# Altium schematic sheet LVHVSCH.SchDoc
size A2
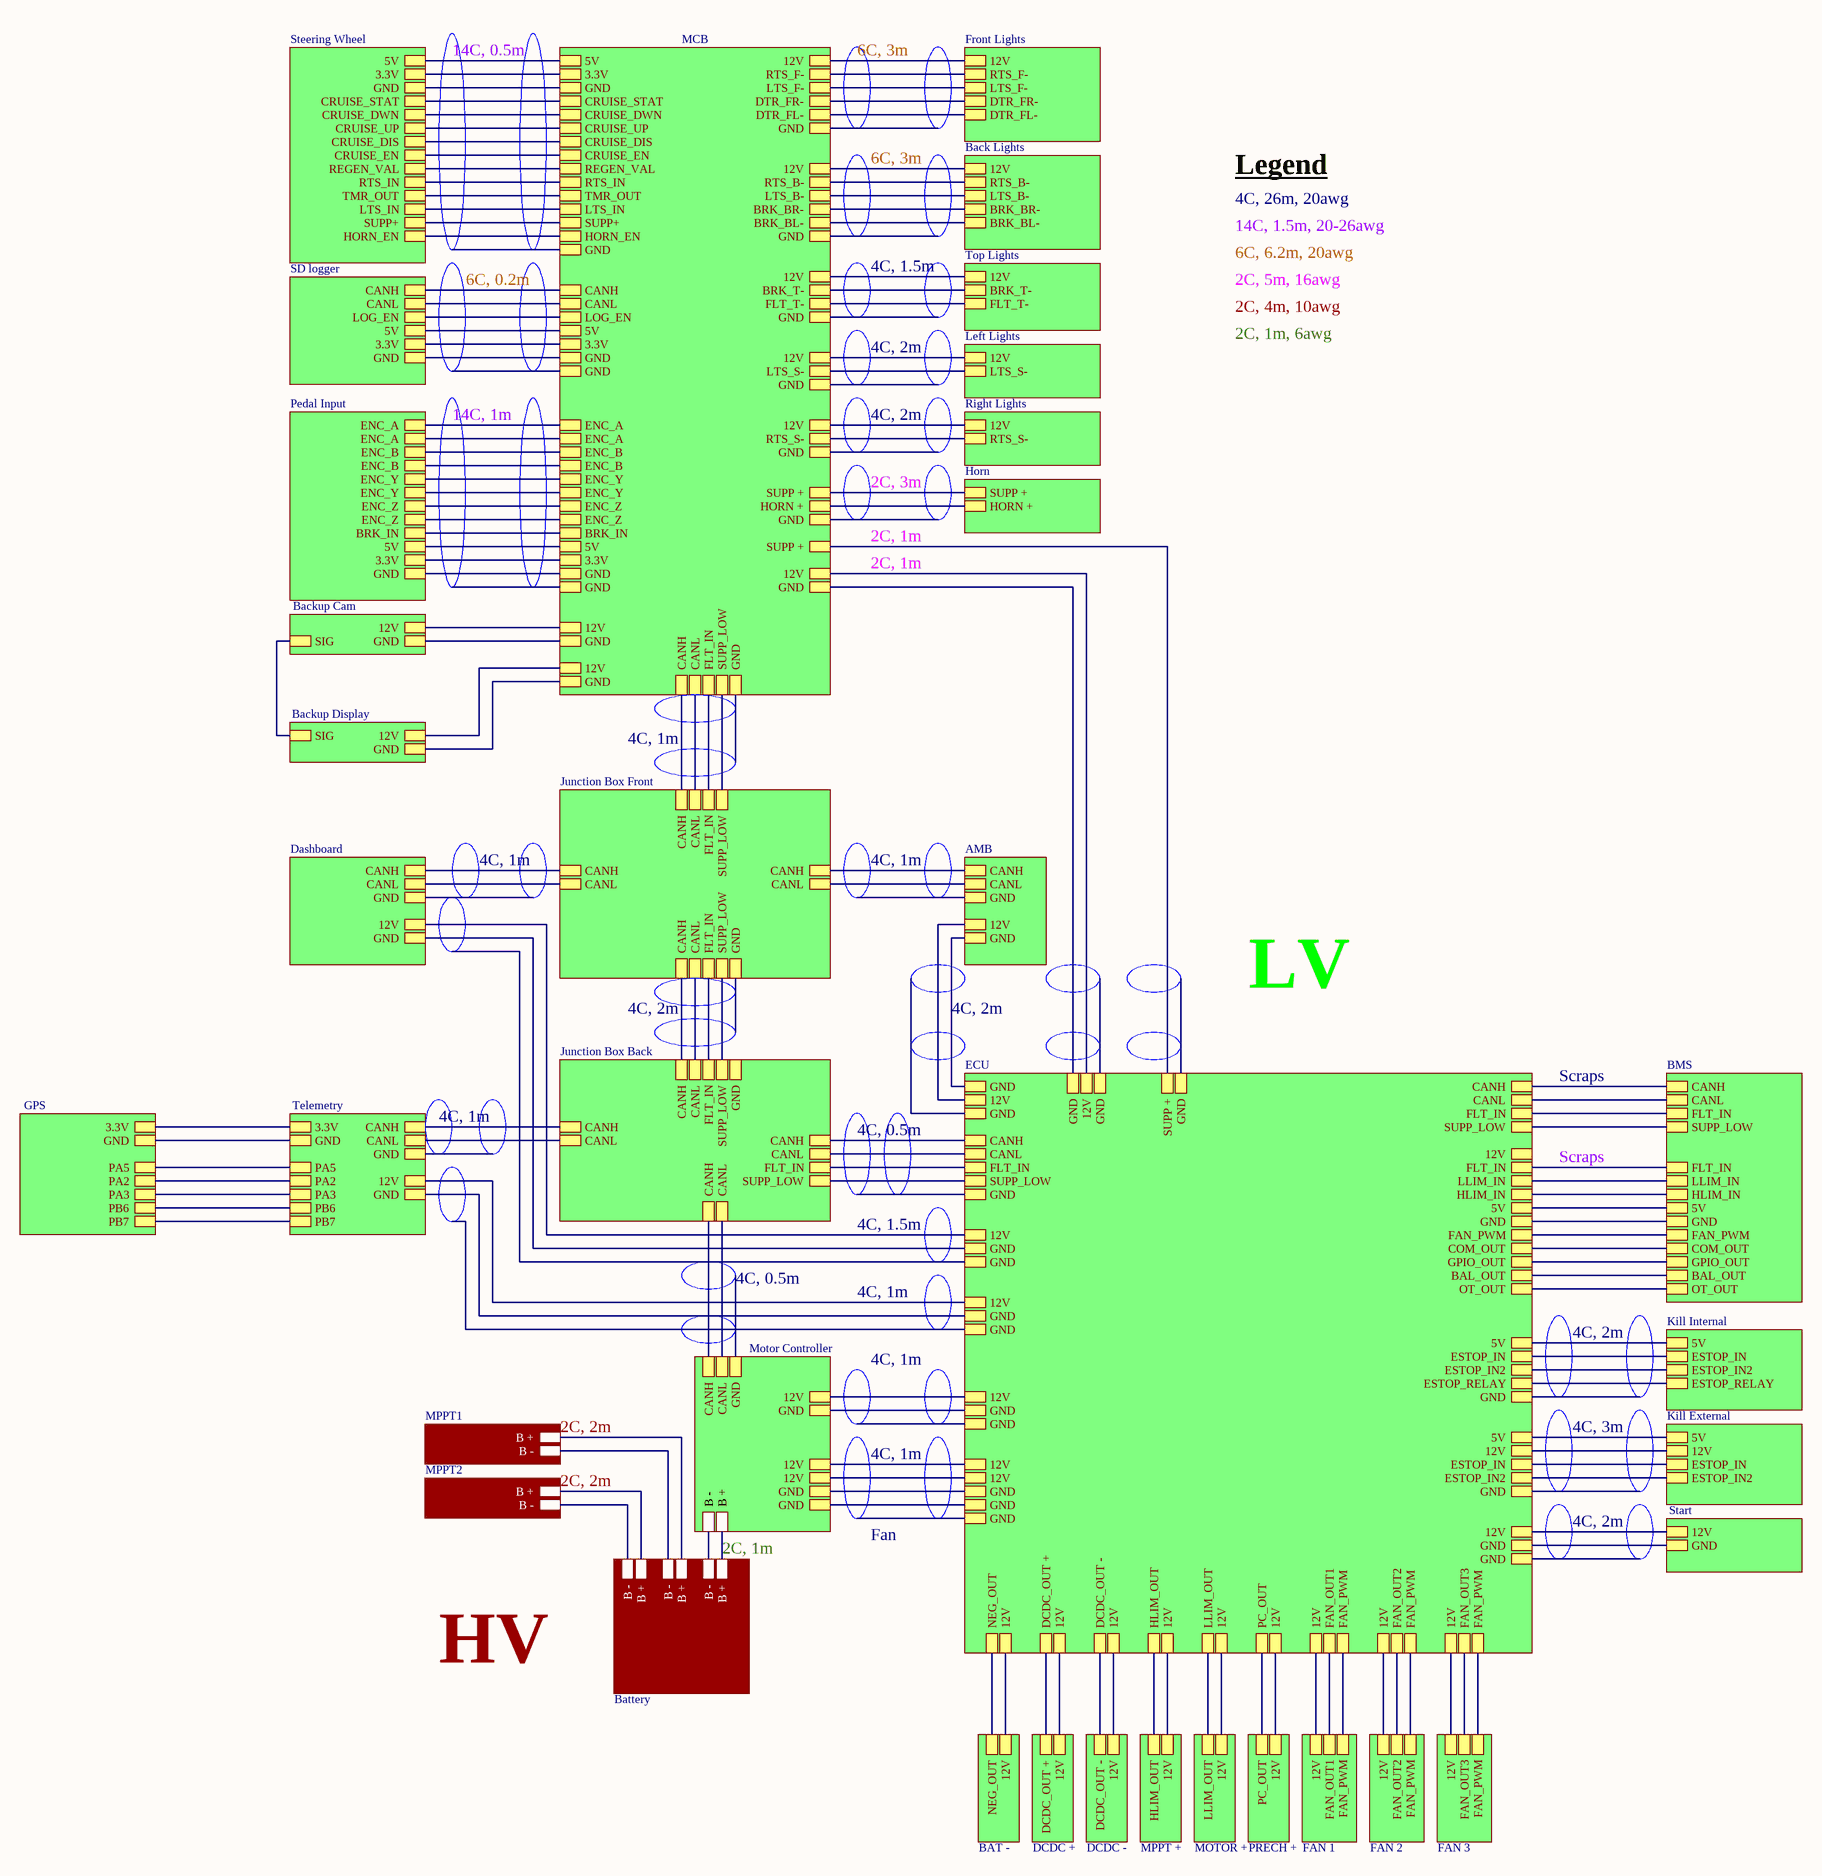
[diagram p0: LVHVSCH.SchDoc]

## Sub-sheets
? = MCB: 12V, RTS_F-, LTS_F-, DTR_FR-, DTR_FL-, RTS_B-, LTS_B-, BRK_BR-, BRK_BL-, LTS_S-, RTS_S-, BRK_T-, FLT_T-, 5V, 3.3V, GND, CRUISE_STAT, CRUISE_DWN, CRUISE_UP, CRUISE_DIS, CRUISE_EN, REGEN_VAL, RTS_IN, TMR_OUT, LTS_IN, SUPP+, HORN_EN, CANH, CANL, LOG_EN, ENC_A, ENC_B, ENC_Y, ENC_Z, BRK_IN, 12V, 12V, 12V, 12V, 5V, 3.3V, GND, 5V, 3.3V, GND, CANH, CANL, FLT_IN, SUPP_LOW, SUPP +, HORN +, ENC_A, ENC_B, ENC_Y, ENC_Z, SUPP +, 12V, GND, GND, GND, GND, GND, GND, GND, GND, GND, GND, GND, 12V, 12V, GND, GND
? = Front Lights: 12V, RTS_F-, LTS_F-, DTR_FR-, DTR_FL-
? = Back Lights: 12V, RTS_B-, LTS_B-, BRK_BR-, BRK_BL-
? = Top Lights: BRK_T-, FLT_T-, 12V
? = Left Lights: LTS_S-, 12V
? = Right Lights: 12V, RTS_S-
? = Steering Wheel: 5V, 3.3V, GND, CRUISE_STAT, CRUISE_DWN, CRUISE_UP, CRUISE_DIS, CRUISE_EN, REGEN_VAL, RTS_IN, TMR_OUT, LTS_IN, SUPP+, HORN_EN
? = SD logger: CANH, CANL, LOG_EN, 5V, 3.3V, GND
? = Pedal Input: ENC_A, ENC_B, ENC_Y, ENC_Z, BRK_IN, 5V, 3.3V, GND, ENC_A, ENC_B, ENC_Y, ENC_Z
? = Junction Box Front: CANL, CANH, CANH, CANL, CANH, CANL, FLT_IN, SUPP_LOW, CANH, CANL, FLT_IN, SUPP_LOW, GND
? = Dashboard: CANH, CANL, 12V, GND, GND
? = ECU: CANH, CANL, FLT_IN, SUPP_LOW, CANH, CANL, FLT_IN, SUPP_LOW, 12V, PC_OUT, NEG_OUT, 12V, DCDC_OUT +, 12V, HLIM_OUT, 12V, LLIM_OUT, 12V, 12V, GND, 5V, SUPP +, 12V, GND, ESTOP_IN, ESTOP_IN2, ESTOP_RELAY, 5V, 12V, ESTOP_IN, ESTOP_IN2, 12V, GND, 12V, GND, 12V, GND, 12V, GND, 12V, 12V, GND, GND, GND, GND, GND, GND, GND, GND, GND, GND, GND, GND, GND, FLT_IN, LLIM_IN, HLIM_IN, 12V, 12V, 12V, FAN_OUT1, FAN_OUT2, FAN_OUT3, FAN_PWM, FAN_PWM, FAN_PWM, 12V, 5V, GND, FAN_PWM, COM_OUT, GPIO_OUT, BAL_OUT, OT_OUT, DCDC_OUT -, 12V
? = Junction Box Back: CANL, CANH, CANH, FLT_IN, SUPP_LOW, CANL, CANH, CANL, CANH, CANL, FLT_IN, SUPP_LOW, GND
? = AMB: CANH, CANL, GND, 12V, GND
? = Motor Controller: CANH, CANL, 12V, GND, 12V, GND, 12V, GND, B +, B -, GND
? = Telemetry: CANH, CANL, 12V, GND, GND, 3.3V, GND, PA5, PA2, PA3, PB6, PB7
? = BMS: CANH, CANL, FLT_IN, SUPP_LOW, HLIM_IN, LLIM_IN, FLT_IN, 5V, GND, FAN_PWM, COM_OUT, GPIO_OUT, BAL_OUT, OT_OUT
? = Horn: SUPP +, HORN +
? = Kill Internal: 5V, ESTOP_IN, ESTOP_IN2, ESTOP_RELAY
? = Kill External: 5V, 12V, ESTOP_IN, ESTOP_IN2
? = Start: 12V, GND
? = BAT -: NEG_OUT, 12V
? = DCDC +: DCDC_OUT +, 12V
? = MPPT +: HLIM_OUT, 12V
? = MOTOR +: LLIM_OUT, 12V
? = PRECH +: PC_OUT, 12V
? = Battery: B -, B +, B +, B +, B -, B -
? = MPPT1: B +, B -
? = MPPT2: B +, B -
? = Backup Cam: 12V, GND, SIG
? = Backup Display: 12V, GND, SIG
? = FAN 1: FAN_PWM, 12V, FAN_OUT1
? = FAN 2: FAN_PWM, 12V, FAN_OUT2
? = FAN 3: FAN_PWM, 12V, FAN_OUT3
? = DCDC -: DCDC_OUT -, 12V
? = GPS: 3.3V, GND, PA5, PA2, PA3, PB6, PB7

## Nets
(unnamed): sheet /12V, sheet /12V
(unnamed): sheet /RTS_F-, sheet /RTS_F-
(unnamed): sheet /LTS_F-, sheet /LTS_F-
(unnamed): sheet /DTR_FR-, sheet /DTR_FR-
(unnamed): sheet /DTR_FL-, sheet /DTR_FL-
(unnamed): sheet /RTS_B-, sheet /RTS_B-
(unnamed): sheet /LTS_B-, sheet /LTS_B-
(unnamed): sheet /BRK_BR-, sheet /BRK_BR-
(unnamed): sheet /BRK_BL-, sheet /BRK_BL-
(unnamed): sheet /LTS_S-, sheet /LTS_S-
(unnamed): sheet /RTS_S-, sheet /RTS_S-
(unnamed): sheet /BRK_T-, sheet /BRK_T-
(unnamed): sheet /FLT_T-, sheet /FLT_T-
(unnamed): sheet /5V, sheet /5V
(unnamed): sheet /3.3V, sheet /3.3V
(unnamed): sheet /GND, sheet /GND
(unnamed): sheet /CRUISE_STAT, sheet /CRUISE_STAT
(unnamed): sheet /CRUISE_DWN, sheet /CRUISE_DWN
(unnamed): sheet /CRUISE_UP, sheet /CRUISE_UP
(unnamed): sheet /CRUISE_DIS, sheet /CRUISE_DIS
(unnamed): sheet /CRUISE_EN, sheet /CRUISE_EN
(unnamed): sheet /REGEN_VAL, sheet /REGEN_VAL
(unnamed): sheet /RTS_IN, sheet /RTS_IN
(unnamed): sheet /TMR_OUT, sheet /TMR_OUT
(unnamed): sheet /LTS_IN, sheet /LTS_IN
(unnamed): sheet /SUPP+, sheet /SUPP+
(unnamed): sheet /HORN_EN, sheet /HORN_EN
(unnamed): sheet /CANH, sheet /CANH
(unnamed): sheet /CANL, sheet /CANL
(unnamed): sheet /LOG_EN, sheet /LOG_EN
(unnamed): sheet /ENC_A, sheet /ENC_A
(unnamed): sheet /ENC_B, sheet /ENC_B
(unnamed): sheet /ENC_Y, sheet /ENC_Y
(unnamed): sheet /ENC_Z, sheet /ENC_Z
(unnamed): sheet /BRK_IN, sheet /BRK_IN
(unnamed): sheet /12V, sheet /12V
(unnamed): sheet /12V, sheet /12V
(unnamed): sheet /12V, sheet /12V
(unnamed): sheet /12V, sheet /12V
(unnamed): sheet /5V, sheet /5V
(unnamed): sheet /3.3V, sheet /3.3V
(unnamed): sheet /GND, sheet /GND
(unnamed): sheet /5V, sheet /5V
(unnamed): sheet /3.3V, sheet /3.3V
(unnamed): sheet /GND, sheet /GND
(unnamed): sheet /CANH, sheet /CANH
(unnamed): sheet /CANL, sheet /CANL
(unnamed): sheet /FLT_IN, sheet /FLT_IN
(unnamed): sheet /SUPP_LOW, sheet /SUPP_LOW
(unnamed): sheet /SUPP +, sheet /SUPP +
(unnamed): sheet /HORN +, sheet /HORN +
(unnamed): sheet /ENC_A, sheet /ENC_A
(unnamed): sheet /ENC_B, sheet /ENC_B
(unnamed): sheet /ENC_Y, sheet /ENC_Y
(unnamed): sheet /ENC_Z, sheet /ENC_Z
(unnamed): sheet /SUPP +, sheet /SUPP +
(unnamed): sheet /12V, sheet /12V
(unnamed): sheet /GND, sheet /GND
(unnamed): sheet /12V, sheet /12V
(unnamed): sheet /12V, sheet /12V
(unnamed): sheet /GND, sheet /GND
(unnamed): sheet /GND, sheet /GND
(unnamed): sheet /CANL, sheet /CANL
(unnamed): sheet /CANH, sheet /CANH
(unnamed): sheet /CANH, sheet /CANH
(unnamed): sheet /CANL, sheet /CANL
(unnamed): sheet /CANH, sheet /CANH
(unnamed): sheet /CANL, sheet /CANL
(unnamed): sheet /FLT_IN, sheet /FLT_IN
(unnamed): sheet /SUPP_LOW, sheet /SUPP_LOW
(unnamed): sheet /12V, sheet /12V
(unnamed): sheet /GND, sheet /GND
(unnamed): sheet /CANH, sheet /CANH
(unnamed): sheet /CANL, sheet /CANL
(unnamed): sheet /FLT_IN, sheet /FLT_IN
(unnamed): sheet /SUPP_LOW, sheet /SUPP_LOW
(unnamed): sheet /CANH, sheet /CANH
(unnamed): sheet /CANL, sheet /CANL
(unnamed): sheet /FLT_IN, sheet /FLT_IN
(unnamed): sheet /SUPP_LOW, sheet /SUPP_LOW
(unnamed): sheet /12V, sheet /12V
(unnamed): sheet /PC_OUT, sheet /PC_OUT
(unnamed): sheet /NEG_OUT, sheet /NEG_OUT
(unnamed): sheet /12V, sheet /12V
(unnamed): sheet /DCDC_OUT +, sheet /DCDC_OUT +
(unnamed): sheet /12V, sheet /12V
(unnamed): sheet /HLIM_OUT, sheet /HLIM_OUT
(unnamed): sheet /12V, sheet /12V
(unnamed): sheet /LLIM_OUT, sheet /LLIM_OUT
(unnamed): sheet /12V, sheet /12V
(unnamed): sheet /12V, sheet /12V
(unnamed): sheet /GND, sheet /GND
(unnamed): sheet /5V, sheet /5V
(unnamed): sheet /ESTOP_IN, sheet /ESTOP_IN
(unnamed): sheet /ESTOP_IN2, sheet /ESTOP_IN2
(unnamed): sheet /ESTOP_RELAY, sheet /ESTOP_RELAY
(unnamed): sheet /5V, sheet /5V
(unnamed): sheet /12V, sheet /12V
(unnamed): sheet /ESTOP_IN, sheet /ESTOP_IN
(unnamed): sheet /ESTOP_IN2, sheet /ESTOP_IN2
(unnamed): sheet /12V, sheet /12V
(unnamed): sheet /GND, sheet /GND
(unnamed): sheet /12V, sheet /12V
(unnamed): sheet /GND, sheet /GND
(unnamed): sheet /12V, sheet /12V
(unnamed): sheet /GND, sheet /GND
(unnamed): sheet /12V, sheet /12V
(unnamed): sheet /GND, sheet /GND
(unnamed): sheet /12V, sheet /12V
(unnamed): sheet /GND, sheet /GND
(unnamed): sheet /FLT_IN, sheet /FLT_IN
(unnamed): sheet /LLIM_IN, sheet /LLIM_IN
(unnamed): sheet /HLIM_IN, sheet /HLIM_IN
(unnamed): sheet /12V, sheet /12V
(unnamed): sheet /12V, sheet /12V
(unnamed): sheet /12V, sheet /12V
(unnamed): sheet /FAN_OUT1, sheet /FAN_OUT1
(unnamed): sheet /FAN_OUT2, sheet /FAN_OUT2
(unnamed): sheet /FAN_OUT3, sheet /FAN_OUT3
(unnamed): sheet /FAN_PWM, sheet /FAN_PWM
(unnamed): sheet /FAN_PWM, sheet /FAN_PWM
(unnamed): sheet /FAN_PWM, sheet /FAN_PWM
(unnamed): sheet /5V, sheet /5V
(unnamed): sheet /GND, sheet /GND
(unnamed): sheet /FAN_PWM, sheet /FAN_PWM
(unnamed): sheet /COM_OUT, sheet /COM_OUT
(unnamed): sheet /GPIO_OUT, sheet /GPIO_OUT
(unnamed): sheet /BAL_OUT, sheet /BAL_OUT
(unnamed): sheet /OT_OUT, sheet /OT_OUT
(unnamed): sheet /DCDC_OUT -, sheet /DCDC_OUT -
(unnamed): sheet /12V, sheet /12V
(unnamed): sheet /CANL, sheet /CANL
(unnamed): sheet /CANH, sheet /CANH
(unnamed): sheet /CANH, sheet /CANH
(unnamed): sheet /CANL, sheet /CANL
(unnamed): sheet /B +, sheet /B +
(unnamed): sheet /B -, sheet /B -
(unnamed): sheet /3.3V, sheet /3.3V
(unnamed): sheet /GND, sheet /GND
(unnamed): sheet /PA5, sheet /PA5
(unnamed): sheet /PA2, sheet /PA2
(unnamed): sheet /PA3, sheet /PA3
(unnamed): sheet /PB6, sheet /PB6
(unnamed): sheet /PB7, sheet /PB7
(unnamed): sheet /B -, sheet /B -
(unnamed): sheet /B +, sheet /B +
(unnamed): sheet /B +, sheet /B +
(unnamed): sheet /B -, sheet /B -
(unnamed): sheet /SIG, sheet /SIG

## Notes on the sheet
- 14C, 0.5m
- 6C, 3m
- 4C, 26m, 20awg
- Legend
- 4C, 1.5m
- 14C, 1.5m, 20-26awg
- 6C, 6.2m, 20awg
- 6C, 0.2m
- 2C, 5m, 16awg
- 2C, 4m, 10awg
- 2C, 1m, 6awg
- 4C, 2m
- 14C, 1m
- 2C, 3m
- 2C, 1m
- 4C, 1m
- LV
- Scraps
- 4C, 0.5m
- 2C, 2m
- 4C, 3m
- Fan
- HV